# EAGLE design HBridge328 (EAGLE 7.5.0)
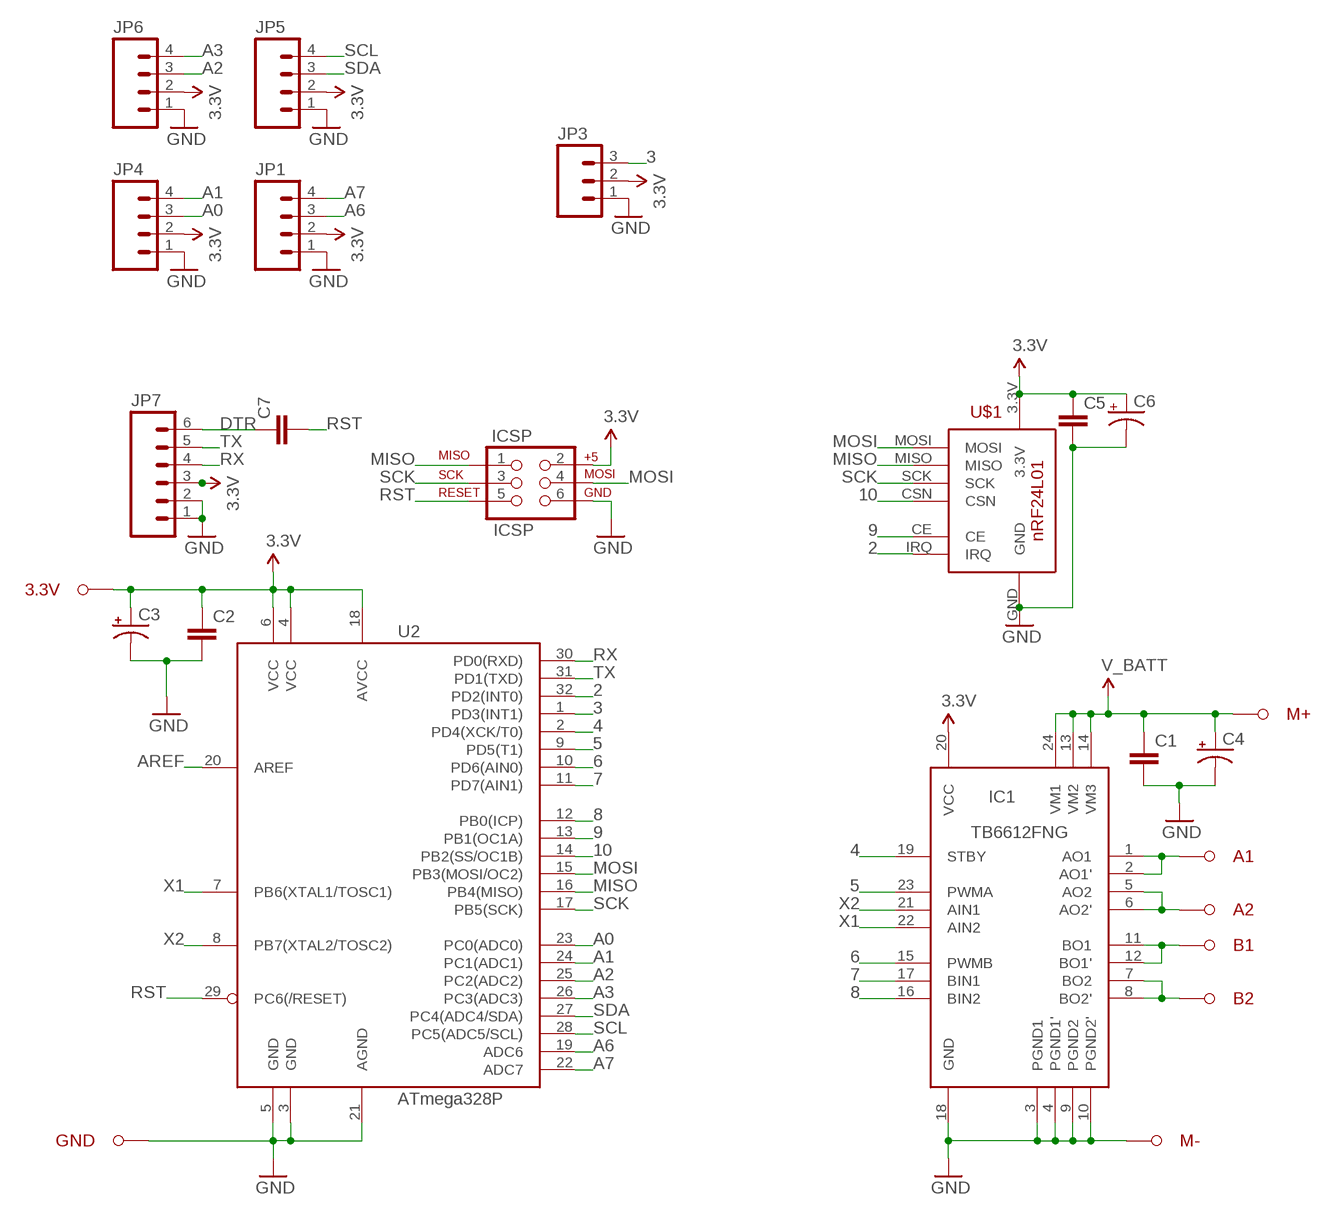
[diagram p0: schematic, sheet 1]

## Parts
3.3V  M1  [M1_NO_STRAIN]
A1  M1  [M1_NO_STRAIN]
A2  M1  [M1_NO_STRAIN]
B1  M1  [M1_NO_STRAIN]
B2  M1  [M1_NO_STRAIN]
C1  CAP1206  [1206]
C2  CAP1206  [1206]
C3  CAP_POL1206  [EIA3216]
C4  CAP_POL1206  [EIA3216]
C5  CAP1206  [1206]
C6  CAP_POL1206  [EIA3216]
C7  CAP1206  [1206]
GND  M1  [M1_NO_STRAIN]
IC1  TB6612  TB6612FNG  [SSOP24]
ICSP  ICSP  AVR_SPI_PRG_6LABELED  [2X3-NS]
JP1  M04PTH  [1X04]
JP3  M03PTH  [1X03]
JP4  M04PTH  [1X04]
JP5  M04PTH  [1X04]
JP6  M04PTH  [1X04]
JP7  M06SILK_FEMALE_PTH  [1X06]
M+  M1  [M1_NO_STRAIN]
M-  M1  [M1_NO_STRAIN]
U2  ATmega328P  ATMEGA328P_TQFP  [TQFP32-08]
U$1  RF24_MODULE  [RF24_SOCKET]

## Nets
2: U2.32(PD2(INT0)) U$1.IRQ
3: JP3.3 U2.1(PD3(INT1))
3.3V: 3.3V.P$1 C2.1 C3.A(+) C5.1 C6.A(+) IC1.20(VCC) ICSP.2(V+) JP1.2 JP3.2 JP4.2 JP5.2 JP6.2 JP7.3 U2.4(VCC) U2.6(VCC) U2.18(AVCC) U$1.3.3V
4: IC1.19(STBY) U2.2(PD4(XCK/T0))
5: IC1.23(PWMA) U2.9(PD5(T1))
6: IC1.15(PWMB) U2.10(PD6(AIN0))
7: IC1.17(BIN1) U2.11(PD7(AIN1))
8: IC1.16(BIN2) U2.12(PB0(ICP))
9: U2.13(PB1(OC1A)) U$1.CE
10: U2.14(PB2(SS/OC1B)) U$1.CSN
A0: JP4.3 U2.23(PC0(ADC0))
A1: JP4.4 U2.24(PC1(ADC1))
A2: JP6.3 U2.25(PC2(ADC2))
A3: JP6.4 U2.26(PC3(ADC3))
A6: JP1.3 U2.19(ADC6)
A7: JP1.4 U2.22(ADC7)
AREF: U2.20(AREF)
DTR: C7.1 JP7.6
GND: C1.2 C2.2 C3.C(-) C4.C(-) C5.2 C6.C(-) GND.P$1 IC1.3(PGND1) IC1.4(PGND1') IC1.9(PGND2) IC1.10(PGND2') IC1.18(GND) ICSP.6(GND) JP1.1 JP3.1 JP4.1 JP5.1 JP6.1 JP7.1 JP7.2 M-.P$1 U2.3(GND) U2.5(GND) U2.21(AGND) U$1.GND
MISO: ICSP.1(MISO) U2.16(PB4(MISO)) U$1.MISO
MOSI: ICSP.4(MOSI) U2.15(PB3(MOSI/OC2)) U$1.MOSI
N$1: A1.P$1 IC1.1(AO1) IC1.2(AO1')
N$2: A2.P$1 IC1.5(AO2) IC1.6(AO2')
N$3: B1.P$1 IC1.11(BO1) IC1.12(BO1')
N$4: B2.P$1 IC1.7(BO2) IC1.8(BO2')
RST: C7.2 ICSP.5(RST) U2.29(PC6(/RESET))
RX: JP7.4 U2.30(PD0(RXD))
SCK: ICSP.3(SCK) U2.17(PB5(SCK)) U$1.SCK
SCL: JP5.4 U2.28(PC5(ADC5/SCL))
SDA: JP5.3 U2.27(PC4(ADC4/SDA))
TX: JP7.5 U2.31(PD1(TXD))
V_BATT: C1.1 C4.A(+) IC1.13(VM2) IC1.14(VM3) IC1.24(VM1) M+.P$1
X1: IC1.22(AIN2) U2.7(PB6(XTAL1/TOSC1))
X2: IC1.21(AIN1) U2.8(PB7(XTAL2/TOSC2))

## Library data of the parts
3.3V A1 A2 B1 B2 GND M+ M- = barbary_enterprises:M1
C1 C2 C5 C7 = barbary_enterprises:CAP: Capacitor Standard 0603 ceramic capacitor, and 0.1" leaded capacitor.
C3 C4 C6 = barbary_enterprises:CAP_POL: Capacitor Polarized These are standard SMD and PTH capacitors. Normally 10uF, 47uF, and 100uF in electrolytic and tantalum varieties. Always verify the external diameter of the through hole cap, it varies with capacity, voltage, and manufacturer. The EIA devices should be standard.
IC1 = barbary_enterprises:TB6612FNG: TB6612FNG MOS dual H-bridge motor driver, 1.2A current 3.2A peak 3 or 5v logic and 3-15v motor
ICSP = barbary_enterprises:AVR_SPI_PRG_6: AVR ISP 6 Pin This is the reduced ISP connector for AVR programming. Common on Arduino. This footprint will take up less PCB space and can be used with a 10-pin to 6-pin adapter such as SKU: BOB-08508
JP1 JP4-JP6 = SparkFun-Connectors:M04: Header 4 Standard 4-pin 0.1" header. Use with straight break away headers (SKU : PRT-00116), right angle break away headers (PRT-00553), swiss pins (PRT-00743), machine pins (PRT-00117), and female headers (PRT-00115). Molex polarized connector foot print use with SKU : PRT-08231 with associated crimp pins and housings. 1MM SMD Version SKU: PRT-10208
JP3 = SparkFun-Connectors:M03: Header 3 Standard 3-pin 0.1" header. Use with straight break away headers (SKU : PRT-00116), right angle break away headers (PRT-00553), swiss pins (PRT-00743), machine pins (PRT-00117), and female headers (PRT-00115). Molex polarized connector foot print use with SKU : PRT-08232 with associated crimp pins and housings.
JP7 = SparkFun-Connectors:M06: Header 6 Standard 6-pin 0.1" header. Use with straight break away headers (SKU : PRT-00116), right angle break away headers (PRT-00553), swiss pins (PRT-00743), machine pins (PRT-00117), and female headers (PRT-00115). Molex polarized connector foot print use with SKU : PRT-08094 with associated crimp pins and housings. NOTES ON THE VARIANTS LOCK and LOCK_LONGPADS... This footprint was designed to help hold the alignment of a through-hole component (i.e. 6-pin header) while soldering it into place. You may notice that each hole has been shifted either up or down by 0.005 of an inch from it's more standard position (which is a perfectly straight line). This slight alteration caused the pins (the squares in the middle) to touch the edges of the holes. Because they are alternating, it causes a "brace" to hold the component in place. 0.005 has proven to be the perfect amount of "off-center" position when using our standard breakaway headers. Although looks a little odd when you look at the bare footprint, once you have a header in there, the alteration is very hard to notice. Also,if you push a header all the way into place, it is covered up entirely on the bottom side. This idea of altering the position of holes to aid alignment will be further integrated into the Sparkfun Library for other footprints. It can help hold any component with 3 or more connection pins.; PROD_ID: CONN-08437
U2 = AtmelAvr:ATMEGA328P_TQFP; PROD_ID: IC-09069; VALUE: ATMEGA328P_TQFP
U$1 = barbary_enterprises:RF24_MODULE: nRF24L01 2.4GHz Radio/Wireless Transceivers These are a series of 2.4 GHz Radio modules that are all based on the Nordic Semiconductor nRF24L01+ chip. (Details) The Nordic nRF24L01+ integrates a complete 2.4GHz RF transceiver, RF synthesizer, and baseband logic including the Enhanced ShockBurst™ hardware protocol accelerator supporting a high-speed SPI interface for the application controller.

## Board
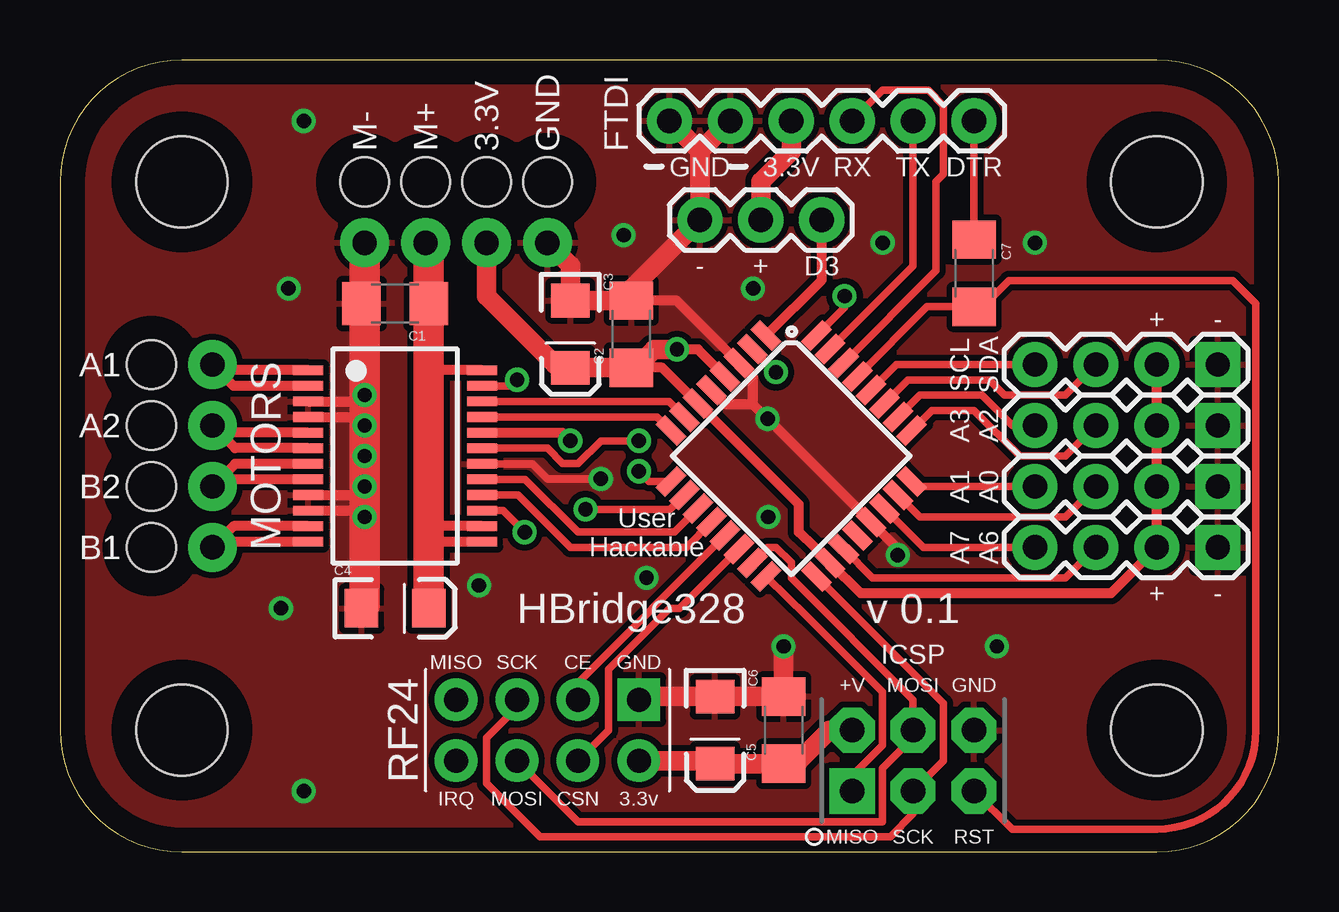
[diagram p1: board, top side]
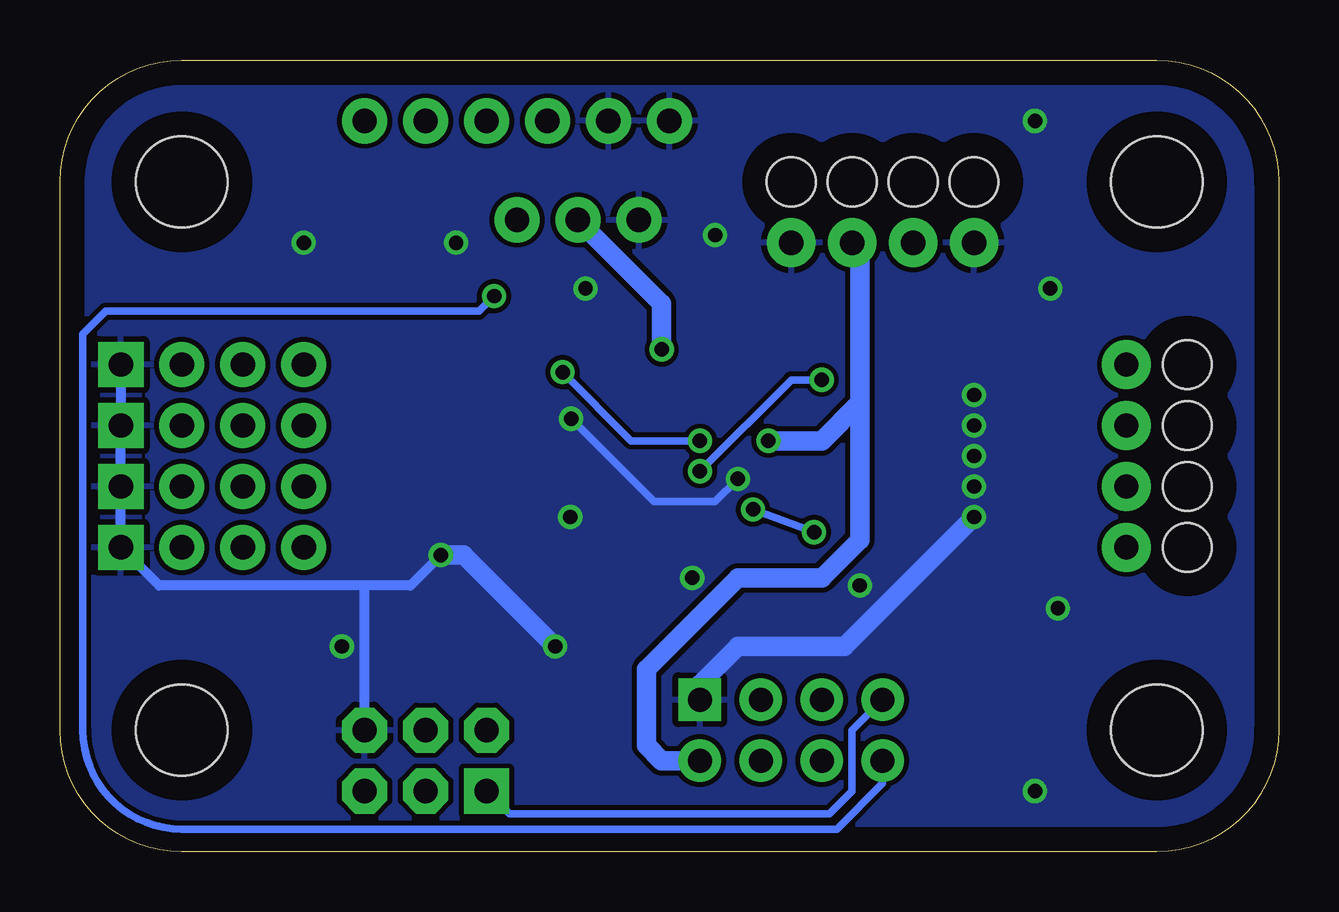
[diagram p2: board, bottom side, seen from below]

Size 50.8 x 33.02 mm. Coordinates in mm from the lower left corner, seen from the top.
Outline: 45.72,33.02 5.08,33.02 arc90 0,27.94 0,5.08 arc90 5.08,0 45.72,0 arc90 50.8,5.08 50.8,27.94 arc90 45.72,33.02
Copper layers (1*16): Top 0.035mm / dielectric 1.5mm / Bottom 0.035mm
Design rules "default": minimum track width 10mil, minimum drill 24mil, track to track 8mil, track to pad 8mil, pad to pad 8mil, via to via 8mil, smd to smd 8mil, copper to edge 40mil, drill to drill 8mil, minimum pad ring 10mil, minimum via ring 8mil, stop-mask expansion 4mil, vias tented up to drill 0mil, thermal gap 10mil
Holes 3.81 mm at 5.08,5.08 5.08,27.94 45.72,5.08 45.72,27.94

### Footprints (pad centres in the part's own frame; a part is rotated, then mirrored left to right if it is on the bottom)
M1_NO_STRAIN = drill 1.016 pad 2.032: P$1 0,0 | hole 2.032: 2.54,0
1206 = smd 1.6 x 1.8: 1 -1.4,0; 2 1.4,0
EIA3216 = smd 1.4 x 1.6: A 1.4,0; C -1.4,0
SSOP24 = smd 0.4 x 1.25: 1 -3.575,-3.625; 2 -2.925,-3.625; 3 -2.275,-3.625; 4 -1.625,-3.625; 5 -0.975,-3.625; 6 -0.325,-3.625; 7 0.325,-3.625; 8 0.975,-3.625; 9 1.625,-3.625; 10 2.275,-3.625; 11 2.925,-3.625; 12 3.575,-3.625; 13 3.575,3.625; 14 2.925,3.625; 15 2.275,3.625; 16 1.625,3.625; 17 0.975,3.625; 18 0.325,3.625; 19 -0.325,3.625; 20 -0.975,3.625; 21 -1.625,3.625; 22 -2.275,3.625; 23 -2.925,3.625; 24 -3.575,3.625
2X3-NS = drill 1.016 pad 1.88 square: 1 -2.54,-1.27 | drill 1.016 pad 1.88 octagon: 2 -2.54,1.27; 3 0,-1.27; 4 0,1.27; 5 2.54,-1.27; 6 2.54,1.27
1X04 = drill 1.016 pad 1.88 square: 1 0,0 | drill 1.016 pad 1.88: 2 2.54,0; 3 5.08,0; 4 7.62,0
1X03 = drill 1.016 pad 1.88: 1 0,0; 2 2.54,0; 3 5.08,0
1X06 = drill 1.016 pad 1.88: 1 0,0; 2 2.54,0; 3 5.08,0; 4 7.62,0; 5 10.16,0; 6 12.7,0
TQFP32-08 = smd 1.27 x 0.559: 1 -4.293,2.8; 2 -4.293,2; 3 -4.293,1.2; 4 -4.293,0.4; 5 -4.293,-0.4; 6 -4.293,-1.2; 7 -4.293,-2; 8 -4.293,-2.8; 17 4.293,-2.8; 18 4.293,-2; 19 4.293,-1.2; 20 4.293,-0.4; 21 4.293,0.4; 22 4.293,1.2; 23 4.293,2; 24 4.293,2.8 | smd 0.559 x 1.27: 9 -2.8,-4.293; 10 -2,-4.293; 11 -1.2,-4.293; 12 -0.4,-4.293; 13 0.4,-4.293; 14 1.2,-4.293; 15 2,-4.293; 16 2.8,-4.293; 25 2.8,4.293; 26 2,4.293; 27 1.2,4.293; 28 0.4,4.293; 29 -0.4,4.293; 30 -1.2,4.293; 31 -2,4.293; 32 -2.8,4.293
RF24_SOCKET = drill 1 pad 1.778: 3.3V 1.27,3.81; CE -1.27,1.27; CSN 1.27,1.27; IRQ 1.27,-3.81; MISO -1.27,-3.81; MOSI 1.27,-1.27; SCK -1.27,-1.27 | drill 1 pad 1.778 square: GND -1.27,3.81

### Placement (x,y rotation side)
3.3V  17.78,25.4 90 top
A1  6.35,20.32 180 top
A2  6.35,17.78 180 top
B1  6.35,12.7 180 top
B2  6.35,15.24 180 top
C1  13.97,22.86 180 top
C2  23.81,21.59 90 top
C3  21.27,21.59 270 top
C4  13.97,10.16 0 top
C5  30.16,5.08 90 top
C6  27.3,5.08 270 top
C7  38.1,24.13 270 top
GND  20.32,25.4 90 top
IC1  13.97,16.51 270 top
ICSP  35.56,3.81 0 top
JP1  48.26,12.7 180 top
JP3  26.67,26.35 0 top
JP4  48.26,15.24 180 top
JP5  48.26,20.32 180 top
JP6  48.26,17.78 180 top
JP7  25.4,30.48 0 top
M+  15.24,25.4 90 top
M-  12.7,25.4 90 top
U2  30.48,16.51 315 top
U$1  20.32,5.08 270 top

### Tracks (layer width: path | path; a pad name or v marks a point on that pad's centre or on a via)
2  (via drill 0.6)
  Top 0.305: v32.7,23.18 32.7,22.69 U2.32
  Bottom 0.305: U$1.IRQ 16.51,2.86 18.41,0.95 45.72,0.95 arc90 49.85,5.08 49.85,21.59 48.9,22.54 33.34,22.54 v32.7,23.18
3
  Top 0.406: U2.1 31.75,23.85 JP3.3
3.3V  (via drill 0.6)
  Top 0.406: JP5.2 JP6.2 JP4.2 JP1.2 43.81,10.79 33.37,10.79 U2.18 31.46,12.7 30.8,13.34 30.8,14.49 U2.6 25.1,20.19 C2.1 24,20.19 | IC1.20 20.93,17.48 v21.27,17.14 | U2.4 26.6,20.95 v25.72,20.95
  Top 0.813: ICSP.2 32.07,5.08 30.8,3.81 30.29,3.81 C5.1 C6.A 27.12,3.81 U$1.3.3V | C2.1 C3.A 21.14,20.32 20.64,20.32 17.78,23.18 3.3V.P$1 | JP7.3 30.48,29.21 29.21,27.94 JP3.2 | 24,20.19 24.77,20.95 v25.72,20.95
  Bottom 0.813: v21.27,17.14 19.05,17.14 17.46,18.73 | 17.46,18.73 17.46,25.08 3.3V.P$1 | JP3.2 25.72,22.86 v25.72,20.95 | U$1.3.3V 25.72,3.81 26.35,4.45 26.35,7.62 22.54,11.43 19.05,11.43 17.46,13.02 17.46,18.73
4  (via drill 0.6)
  Top 0.305: IC1.19 20.31,16.84 20.95,16.19 21.59,16.19 22.54,17.14 v24.13,17.14 | v29.84,20 29.82,20 U2.2
  Bottom 0.305: v24.13,17.14 26.99,17.14 v29.84,20
5  (via drill 0.6)
  Top 0.305: IC1.23 18.8,19.43 v19.05,19.68 | v24.13,15.88 24.55,15.46 U2.9
  Bottom 0.305: v19.05,19.68 20.32,19.68 v24.13,15.88
6  (via drill 0.6)
  Top 0.305: U2.10 25.43,14.29 v21.91,14.29 | v19.37,13.34 18.47,14.23 IC1.15
  Bottom 0.305: v21.91,14.29 v19.37,13.34
7
  Top 0.305: U2.11 25.61,13.34 21.59,13.34 19.39,15.54 IC1.17
8
  Top 0.305: U2.12 26.1,12.7 21.27,12.7 19.09,14.88 IC1.16
9
  Top 0.305: U$1.CE 21.59,7.05 U2.13
10
  Top 0.305: U$1.CSN 22.86,5.08 22.86,7.62 25.4,10.16 25.83,10.16 U2.14
A0
  Top 0.305: JP4.3 41.91,13.97 35.85,13.97 U2.23
A1
  Top 0.305: JP4.4 35.71,15.24 U2.24
A2
  Top 0.305: JP6.3 41.91,16.51 40.01,16.51 38.1,18.41 36.34,18.41 U2.25
A3
  Top 0.305: JP6.4 39.69,17.78 38.42,19.05 35.85,19.05 U2.26
A6
  Top 0.305: JP1.3 41.91,11.43 33.86,11.43 U2.19
A7
  Top 0.305: JP1.4 35.99,12.7 U2.22
DTR
  Top 0.305: JP7.6 C7.1
GND  (via drill 0.6)
  Top 0.305: IC1.18 19.69,16.18 20.32,15.56 v22.54,15.56
  Top 0.406: IC1.3 12.65,18.79 12.7,18.73 | IC1.4 12.66,18.14 12.7,18.1 | IC1.9 12.66,14.88 12.7,14.92 | IC1.10 12.65,14.23 12.7,14.29 | v34.92,12.38 34.92,12.63 U2.21 v29.49,18.06 28.89,18.66 | C2.2 25.7,22.99 U2.3 28.89,19.8 28.89,18.66 | 28.89,18.66 27.76,18.66 U2.5
  Top 0.813: GND.P$1 21.27,24.45 C3.C C2.2 23.81,23.5 JP3.1 26.67,29.21 | JP7.1 26.67,29.21 | JP7.2 26.67,29.21 | v30.16,8.57 C5.2 C6.C 24.26,6.48 U$1.GND
  Top 1.27: C4.C 12.7,10.29 v12.7,13.97 12.7,14.29 12.7,14.92 12.7,18.1 12.7,18.73 12.7,22.73 C1.2 12.7,22.99 M-.P$1
  Bottom 0.305: v22.54,15.56 23.5,14.61 26.04,14.61 v29.49,18.06
  Bottom 0.406: v34.92,12.38 36.2,11.11 38.1,11.11 | 38.1,11.11 46.67,11.11 JP1.1 JP4.1 JP6.1 JP5.1 | ICSP.6 38.1,11.11
  Bottom 0.813: v30.16,8.57 33.97,12.38 v34.92,12.38 | U$1.GND 24.13,6.99 22.54,8.57 18.1,8.57 v12.7,13.97
  other vias: 40.64,25.4 34.29,25.4 28.89,23.5 23.5,25.72 9.53,23.5 9.21,10.16 17.46,11.11 39.05,8.57 29.53,13.97 10.16,30.48 10.16,2.54 24.45,11.43 12.7,15.24 12.7,19.05 12.7,17.78 12.7,16.51
  pour Top (isolate 0.254): 0.32,0.32 50.48,0.32 50.48,32.7 0.32,32.7
  pour Bottom: 0.32,0.32 50.48,0.32 50.48,32.7 0.32,32.7
MISO
  Top 0.305: ICSP.1 33.02,3.17 34.29,4.45 34.29,6.67 31.11,9.84 29.49,11.43 U2.16
  Bottom 0.305: U$1.MISO 17.78,5.08 17.78,2.54 18.73,1.59 32.07,1.59 ICSP.1
MOSI
  Top 0.305: U2.15 29.5,12.7 29.84,12.7 30.48,12.06 30.48,11.43 35.56,6.35 ICSP.4 35.56,4.76 34.29,3.49 34.29,1.27 21.59,1.27 U$1.MOSI
N$1
  Top 0.406: IC1.1 6.58,20.09 A1.P$1 7.24,19.43 IC1.2
N$2
  Top 0.406: IC1.5 6.64,17.48 A2.P$1 7.29,16.84 IC1.6
N$3
  Top 0.406: IC1.11 7.24,13.59 B1.P$1 6.58,12.94 IC1.12
N$4
  Top 0.406: IC1.8 6.64,15.54 B2.P$1 7.29,16.18 IC1.7
RST
  Top 0.305: U2.29 36.13,22.73 C7.2 38.29,22.54 39.56,23.81 48.9,23.81 49.85,22.86 49.85,5.08 arc-90 45.72,0.95 39.69,0.95 ICSP.5
RX
  Top 0.305: U2.30 36.51,24.24 36.51,27.94 36.83,28.26 36.83,31.11 36.2,31.75 34.29,31.75 JP7.4
SCK
  Top 0.305: U2.17 36.83,6.2 36.83,3.81 ICSP.3 35.56,1.59 34.61,0.64 20,0.64 17.78,2.86 17.78,4.76 19.05,6.03 U$1.SCK
SCL
  Top 0.305: JP5.4 34.86,20.32 U2.28
SDA
  Top 0.305: JP5.3 41.91,19.05 39.37,19.05 38.73,19.68 35.35,19.68 U2.27
TX
  Top 0.305: U2.31 35.56,24.42 JP7.5
V_BATT
  Top 0.406: IC1.24 15.45,20.09 15.37,20 | IC1.13 15.45,12.94 15.37,13.02 | IC1.14 15.44,13.59 15.37,13.65
  Top 1.27: C4.A 15.37,13.02 15.37,13.65 15.37,20 C1.1 15.37,25.27 M+.P$1
X1
  Top 0.305: IC1.22 25.38,18.79 U2.7
X2
  Top 0.305: IC1.21 24.89,18.14 U2.8

### Text on the board
tPlace: FTDI | GND | 3.3V | RX | TX | DTR | - | + | D3 | + | - | SCL / SDA | A3 / A2 | MOTORS | A1 / A0 | User / Hackable | A7 / A6 | + | - | HBridge328 | v 0.1 | ICSP